# Altium schematic sheet Power_and_ST-link_zone.SchDoc
size A4; SheetNumber: 1; SheetTotal: 5
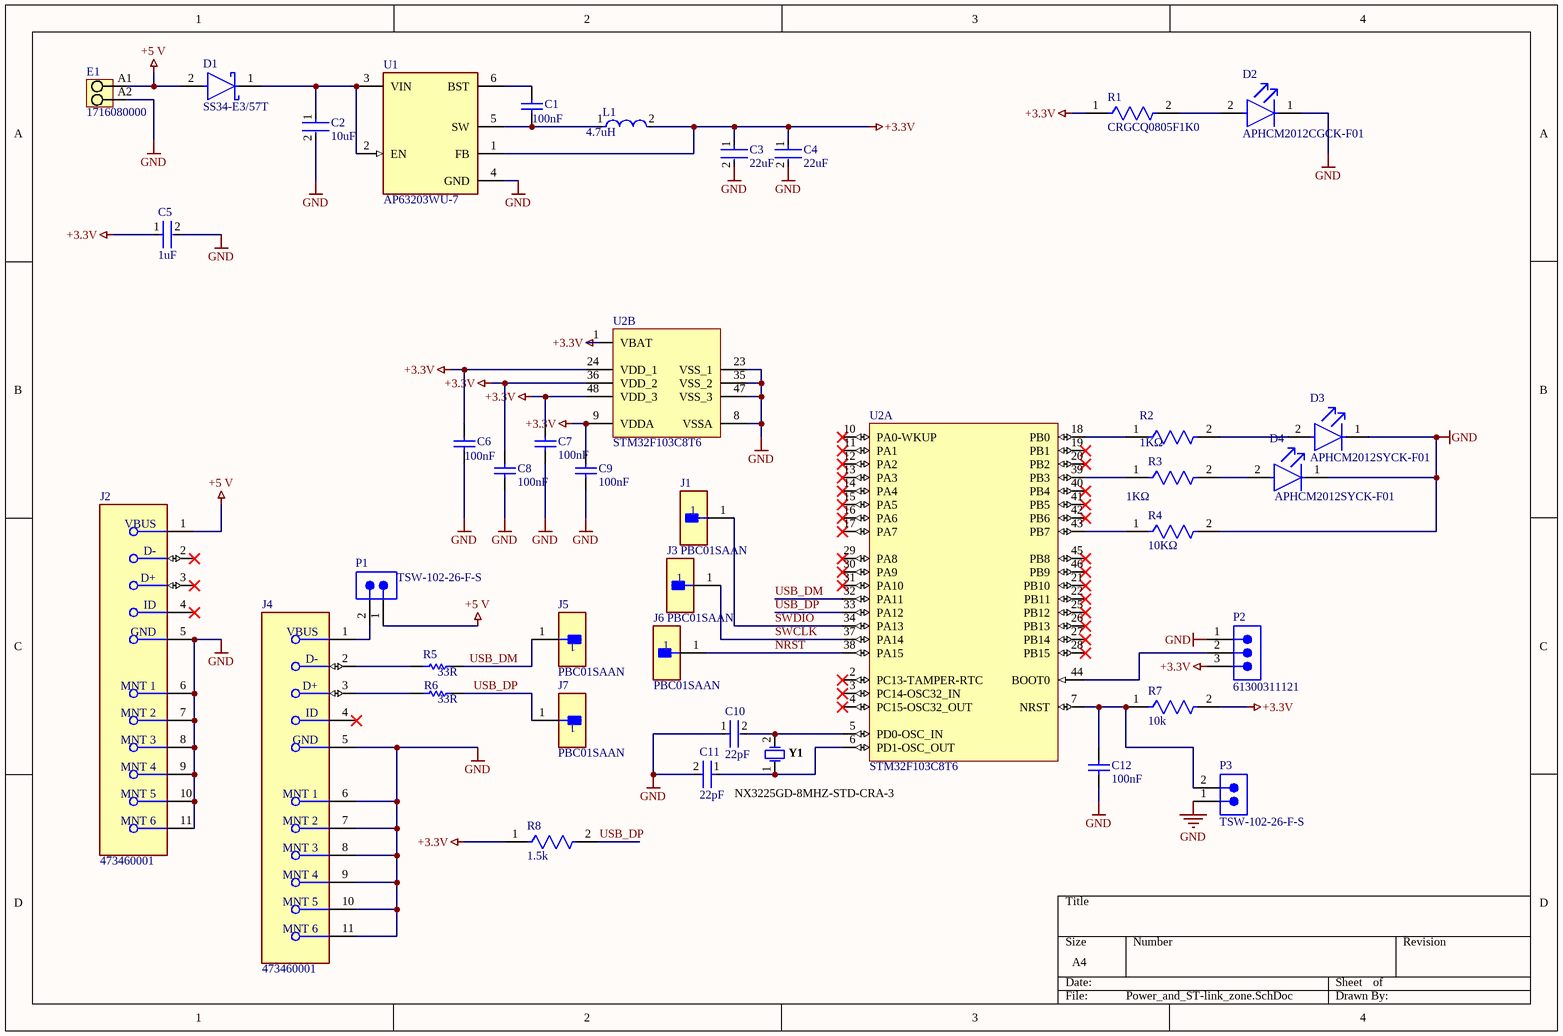
[diagram p0: Power_and_ST-link_zone.SchDoc]

## Parts
C1  100nF  [CAPC2013X145X50NL20T25]
C2  10uF  [FP-C1206C-EH-MFG]
C3  22uF  [FP-GRM21B-0_2-e0_2_0_7-MFG]
C4  22uF  [FP-GRM21B-0_2-e0_2_0_7-MFG]
C5  1uF  [FP-CC0805-0_85-MFG]
C6  100nF  [CAPC2013X145X50NL20T25]
C7  100nF  [CAPC2013X145X50NL20T25]
C8  100nF  [CAPC2013X145X50NL20T25]
C9  100nF  [CAPC2013X145X50NL20T25]
C10  22pF  [FP-C0805C-DN-MFG]
C11  22pF  [FP-C0805C-DN-MFG]
C12  100nF  [CAPC2013X145X50NL20T25]
D1  SS34-E3/57T  [FP-95402-MFG]
D2  APHCM2012CGCK-F01  [FP-APHCM2012CGCK-F01-MFG]
D3  APHCM2012SYCK-F01  [FP-APHCM2012SYCK-F01-MFG]
D4  APHCM2012SYCK-F01  [FP-APHCM2012SYCK-F01-MFG]
E1  1716080000  [LM_5_08_90_02]
J1  PBC01SAAN  [FP-PBC01SAAN-MFG]
J2  473460001  [FP-473460001-MFG]
J3  PBC01SAAN  [FP-PBC01SAAN-MFG]
J4  473460001  [FP-473460001-MFG]
J5  PBC01SAAN  [FP-PBC01SAAN-MFG]
J6  PBC01SAAN  [FP-PBC01SAAN-MFG]
J7  PBC01SAAN  [FP-PBC01SAAN-MFG]
L1  4.7uH  [FP-DEM3518C-MFG]
P1  TSW-102-26-F-S  [SMTC-TSW-102-26-XX-S]
P2  61300311121  [61300311121]
P3  TSW-102-26-F-S  [SMTC-TSW-102-26-XX-S]
R1  CRGCQ0805F1K0  [FP-CRGCQ0805-IPC_C]
R2  1KΩ  [FP-CRGCQ0805-IPC_C]
R3  1KΩ  [FP-CRGCQ0805-IPC_C]
R4  10KΩ  [FP-CRGP0805-IPC_C]
R5  33R  [RESC2013X50X30ML20T20]
R6  33R  [RESC2013X50X30ML20T20]
R7  10k  [FP-CRGP0805-IPC_C]
R8  1.5k  [FP-CRGCQ0805-IPC_C]
U1  AP63203WU-7  [FP-TSOT26-MFG]
U2  STM32F103C8T6  [STM-LQFP48_L]  (parts A,B of 2)
Y1  NX3225GD-8MHZ-STD-CRA-3  [NDK-NX3225GD-8MHZ-STD-CRA-3_V]

## Nets
+3.3V: C3.1 C4.1 C5.1 C6.2 C7.2 C8.2 C9.2 L1.2 P2.3 R1.1 R7.2 R8.1 U1.1(FB) U2.1(VBAT) U2.9(VDDA) U2.24(VDD_1) U2.36(VDD_2) U2.48(VDD_3)
+5 V: D1.2(A) E1.A1 J2.1(VBUS) P1.1
GND: C2.2 C3.2 C4.2 C5.2 C6.1 C7.1 C8.1 C9.1 C10.1 C11.2 C12.1 D2.1(C) D3.1(C) D4.1(C) E1.A2 J2.5(GND) J2.6(MNT_1) J2.7(MNT_2) J2.8(MNT_3) J2.9(MNT_4) J2.10(MNT_5) J2.11(MNT_6) J4.5(GND) J4.6(MNT_1) J4.7(MNT_2) J4.8(MNT_3) J4.9(MNT_4) J4.10(MNT_5) J4.11(MNT_6) P2.1 P3.1 R4.2 U1.4(GND) U2.8(VSSA) U2.23(VSS_1) U2.35(VSS_2) U2.47(VSS_3)
NRST: J6.1 U2.38(PA15)
SWCLK: J3.1 U2.37(PA14)
SWDIO: J1.1 U2.34(PA13)
USB_DM: J5.1 R5.2 U2.32(PA11)
USB_DP: J7.1 R6.2 R8.2 U2.33(PA12)
NetC1_1: C1.1 L1.1 U1.5(SW)
NetC1_2: C1.2 U1.6(BST)
NetC2_1: C2.1 D1.1(C) U1.2(EN) U1.3(VIN)
NetC10_2: C10.2 U2.5(PD0-OSC_IN) Y1.2
NetC11_1: C11.1 U2.6(PD1-OSC_OUT) Y1.1
NetC12_2: C12.2 P3.2 R7.1 U2.7(NRST)
NetD2_2: D2.2(A) R1.2
NetD3_2: D3.2(A) R2.2
NetD4_2: D4.2(A) R3.2
NetJ4_1: J4.1(VBUS) P1.2
NetJ4_2: J4.2(D-) R5.1
NetJ4_3: J4.3(D+) R6.1
NetP2_2: P2.2 U2.44(BOOT0)
NetR2_1: R2.1 U2.18(PB0)
NetR3_1: R3.1 U2.39(PB3)
NetR4_1: R4.1 U2.43(PB7)

Not connected (* = marked no-connect by the designer): J2 2(D-)* 3(D+)* 4(ID)*; J4 4(ID)*; U2 2(PC13-TAMPER-RTC)* 3(PC14-OSC32_IN)* 4(PC15-OSC32_OUT)* 10(PA0-WKUP)* 11(PA1)* 12(PA2)* 13(PA3)* 14(PA4)* 15(PA5)* 16(PA6)* 17(PA7)* 19(PB1)* 20(PB2)* 21(PB10)* 22(PB11)* 25(PB12)* 26(PB13)* 27(PB14)* 28(PB15)* 29(PA8)* 30(PA9)* 31(PA10)* 40(PB4)* 41(PB5)* 42(PB6)* 45(PB8)* 46(PB9)*

## Library data of the parts
C1 C6-C9 C12 = CMP-2007-01227-1: Manufacturer: Kemet; Part Number: C0805S104K5RACTU
C2 = CMP-03020-004605-1: CAP CER 10UF 25V X7R 1206; Manufacturer Part Number: C1206C106K3RACAUTO; Manufacturer: KEMET; Material: Ceramic; Automotive Grade: Grade 1; Temperature Coefficient: 15%; Tolerance: 10%; Digikey Description: CAP CER 10UF 25V X7R 1206; Lead Free: Yes; Temperature Characteristic: X7R; Temperature: -55°C to +125°C; Temperature Range Low: -55°C; Octopart: https://octopart.com/c1206c106k3racauto-kemet-65707106; Temperature Range High: +125°C; RoHS: TRUE; Package: C1206C-EH; Device Class L1: Passive Components; Device Class L3: Ceramic Capacitors; Automotive: Yes; Value: 10uF; Category: Cap; ComponentLink2Description: Datasheet; Capacitance: 10uF; Height: 1.8mm; ComponentLink2URL: https://content.kemet.com/datasheets/KEM_C1023_X7R_AUTO_SMD.pdf; Voltage Rating: 25V; Device Class L2: Capacitors; Ipc Land Pattern Name: CAPC320160X160
C3 C4 = CMP-06035-051066-1: Chip Multilayer Ceramic Capacitors for General Purpose, 0805, 22uF, X7R, 15%, 20%, 10V
C5 = CMP-03422-000058-1: CC0805 1 uF X7R 10.00% 16 V; Manufacturer: Yageo; Manufacturer Part Number: CC0805KFX7R7BB105; Material: Ceramic; Tolerance: 0.1; Voltage Rating: 16 V; ComponentLink2URL: http://www.yageo.com/documents/recent/UPY-GPHC_Y5V_6.3V-to-50V_8.pdf; Capacitance: 1 uF; Octopart: https://octopart.com/cc0805kfx7r7bb105-yageo-30261725; Footprint Url: http://www.yageo.com/exep/pages/download/literatures/UPY-C_GEN_24.pdf; ComponentLink2Description: Datasheet; Ipc Land Pattern Name: CAPC200125X85; Category: Cap; Device Class L1: Passive Components; Temperature Range High: +85°C; Mouser Description: Multilayer Ceramic Capacitors MLCC - SMD/SMT 1.0uF 16V X7R 10%; Height: 0.95mm; Automotive: No; Device Class L3: Ceramic Capacitors; Temperature: -30°C to +85°C; Temperature Range Low: -30°C; Temperature Characteristic: X7R; Device Class L2: Capacitors; Lead Free: Yes; Value: 1 uF; RoHS: TRUE; Package: CC0805-0.85
C10 C11 = CMP-03020-031064-1: C0805 22 pF C0G 30ppm/°C 10.00% 50 V; Manufacturer Part Number: C0805C220K5GACAUTO; Manufacturer: KEMET; Tolerance: 0.1; Voltage Rating: 50 V; Material: Ceramic; Temperature Range High: +125°C; Package: C0805C-DN; Device Class L1: Passive Components; ComponentLink2URL: https://content.kemet.com/datasheets/KEM_C1003_C0G_SMD.pdf; Lead Free: Yes; Value: 22 pF; Height: 0.88mm; Temperature: -55°C to +125°C; RoHS: TRUE; Device Class L2: Capacitors; Category: Cap; ComponentLink2Description: Datasheet; Device Class L3: Ceramic Capacitors; Automotive: No; Capacitance: 22 pF; Octopart: https://octopart.com/c0805c220k5gacauto-kemet-56246248; Temperature Coefficient: 30ppm/°C; Ipc Land Pattern Name: CAPC200125X78; Temperature Characteristic: C0G; Temperature Range Low: -55°C
D1 = CMP-02539-000012-1: DIODE SCHOTTKY 40V 3A DO214AB; Manufacturer: Vishay; Max Junction Temp: +150°C; Peak Reverse Current: 0.5mA; Max Surge Forward Current: 100A; Standoff Height: 0mm; ComponentLink2Description: Datasheet; Device Class L3: Schottky Diodes; Height: 2.62mm; Max Repetitive Reverse Voltage: 40V; Lead Free: Yes; Package: 95402; Temperature Range High: +150°C; ComponentLink2URL: http://www.vishay.com/docs/88751/ss32.pdf; Temperature: -55°C to +150°C; Footprint Url: http://www.vishay.com/docs/95402/smc.pdf; Automotive: No; Forward Current: 3A; Category: Diode; Manufacturer Part Number: SS34-E3/57T; RoHS: TRUE; Device Class L2: Diodes; Mouser Description: Schottky Diodes & Rectifiers 3.0 Amp 40 Volt; Octopart: https://octopart.com/ss34-e3%2F57t-vishay-39552907; Temperature Range Low: -55°C; Device Class L1: Discrete Semiconductors; Digikey Description: DIODE SCHOTTKY 40V 3A DO214AB
D2 = CMP-44529-000062-1: LED GREEN CLEAR CHIP SMD; Dominant Wavelength: 570nm; Forward Current: 20mA; Number of LEDs: 1; Luminous Intensity: 40mcd; Forward Voltage: 2.1V; Viewing Angle: 110°; Illumination Color: Green; Lens Style: Clear; Mount: Surface Mount; Length: 2mm; Max Operating Temperature: 85°C; Series: APHCM; Width: 1.25mm; Lead Free: Lead Free; Wavelength: 570nm; Package Quantity: 1; Number of Pins: 2; Case Code (Metric): 2012; RoHS Compliant: Yes; Packaging: Tape and Reel; Lens Color: Clear; Case/Package: 0805; Case Code (Imperial): 0805; Test Current: 20mA; Color: Green; Min Operating Temperature: -40°C; Height: 0.4mm
D3 D4 = CMP-44529-000064-1: LED YELLOW CLEAR CHIP SMD; Number of LEDs: 1; Luminous Intensity: 150mcd; Dominant Wavelength: 590nm; Test Current: 20mA; Illumination Color: Green; Forward Voltage: 2V; Viewing Angle: 110°; Number of Pins: 2; Packaging: Tape and Reel; Width: 1.25mm; Height: 0.4mm; Lens Color: Clear; RoHS Compliant: Yes; Lead Free: Lead Free; Min Operating Temperature: -40°C; Case Code (Imperial): 0805; Case/Package: 0805; Series: APHCM; Wavelength: 590nm; Max Operating Temperature: 85°C; Length: 2mm; Color: Yellow; Package Quantity: 2000; Mount: Surface Mount; Lens Style: Clear; Forward Current: 20mA; Case Code (Metric): 2012
E1 = CMP-1559-01766-1: OMNIMATE Signal - series LM; Manufacturer: Weidmueller; Solder_pin_length_mm: 3,5 mm; Solid_max_H05_07_V_U: 2,5 mm²; Contact_material: Cu-Leg; No_of_poles: 2; Mounting_onto_the_PCB: Solder connection; Contact_surface: tinned; Wire_cross_section_AWG_max_UL_1059: AWG 14; Rated_voltage_for_surge_voltage_class_pollution_degree_II_2: 630 V; Side_termination_characteristic: closed side; UL_94_flammability_rating: V-0; Wire_cross_section_AWG_min_UL_1059: AWG 24; Pitch_mm: 5,08 mm; Pitch_inch: 0,2 inch; Rated_voltage_use_group_B_UL_1059: 300 V; Solid_min_H05_07_V_U: 0,2 mm²; Short_text_for_material: LM 5.08/02/90 3.5SN OR BX; Insulating_material: Wemid (PA); Rated_current_use_group_B_UL_1059: 15 A; PartNumber: 1716080000; Colour: Orange; ComponentLink1URL: http://www.weidmueller.com/; ComponentLink1Description: Manufacturer URL; Revision: V1; Qty: 500 PCS; ComponentLink2Description: URL Link1; ComponentLink2URL: http://catalog.weidmueller.com/catalog/Start.do?localeId=en&ObjectID=1716080000; Packaging: Box; PackageReference: LM_5_08_90_02
J1 J3 J5-J7 = CMP-25680-000032-1: CONN HEADER VERT 1POS; Number of Positions: 1; Connector Type: Male Pin; Gender: Male; Pitch: 2.54mm; Contact Material: Bronze; Mount: Through Hole; Length: 2.54mm; Height: 2.54mm; Lead Free: Lead Free; Number of Rows: 1; Contact Plating: Gold; Number of Contacts: 1; Housing Material: Plastic; Termination: Solder; Package Quantity: 1; Packaging: Bulk; Color: Black; Contact Mating Length: 0.23inch; Housing Color: Black; Width: 2.54mm
J2 J4 = CMP-2000-05246-2: CONN RCPT USB2.0 MICRO B SMD R/A; Manufacturer: Molex; Conn Orientation: Right Angle; Is Female: yes; Shielding: true; Pitch: 0.65mm; Number Of Contacts: 5; Voltage Rating: 30V; Current Rating: 1.8A; Device Class L2: USB Connectors; Digikey Description: CONN RCPT USB2.0 MICRO B SMD R/A; Height: 2.945mm; RoHS: TRUE; ComponentLink2Description: Datasheet; Octopart: https://octopart.com/47346-0001-molex-7164928; Automotive: No; Package: 0; Category: Conn; Device Class L1: Connectors; Usb Standard: USB 2.0; Temperature: -30°C to +85°C; Temperature Range Low: -30°C; Footprint Url: https://www.molex.com/pdm_docs/sd/473460001_sd.pdf; ComponentLink2URL: https://www.molex.com/webdocs/datasheets/pdf/en-us/0473460001_IO_CONNECTORS.pdf; Lead Free: Yes; Manufacturer Part Number: 473460001; Contact Material: Gold,Nickel; Temperature Range High: +85°C; Device Class L3: unset
L1 = CMP-06042-016301-1: FIXED IND; Shielding: Shielded; Saturation Current: 1.35A; Test Frequency: 100kHz; DC Resistance (DCR): 72mR; Core Material: Ferrite; Current Rating: 2A; Tolerance: 20%; Height - Seated (Max): 0.071inch; RoHS Compliant: Yes; Length: 0.146inch; Min Operating Temperature: -40°C; Max Operating Temperature: 85°C; Mount: Surface Mount; Case/Package: Nonstandard; Width: 0.154inch; Packaging: Tape and Reel; Resistor Type: Wirewound; Inductance: 4.7uH
P1 P3 = CMP-1024-00329-1: 0.025" SQ Post Header, Through-hole, Vertical, -55 to 125 degC, 2.54 mm Pitch, 2-Pin, Male, RoHS; Manufacturer: Samtec; Pitch: 2.54 mm; PackageVersion: DM, 8/1988; ComponentLink2Description: Datasheet; PackageReference: TSW-102-26-XX-S; ComponentLink3URL: http://www.samtec.com/documents/webfiles/cpdf/TSW-XXX-XX-XXX-X-XX-XXX-MKT.pdf; ComponentLink2URL: http://www.samtec.com/documents/webfiles/pdf/TSW_TH.PDF; ComponentLink1Description: Manufacturer URL; DatasheetVersion: F-214; RoHS: True; ComponentLink3Description: Package Specification; PartNumber: TSW-102-26-F-S; Temperature Range: -55 to 125 degC; Orientation: Vertical; ComponentLink1URL: http://www.samtec.com; PackageDescription: .025[0.64] SQ. Post Terminal Strip Assembly; Mounting Technology: Through-hole
P2 = CMP-1502-01062-3: NexarPartId: 32855521; Current Rating: 3A; Voltage Rating: 250V; Number of Positions: 3; Pitch: 2.54mm; Contact Resistance: 20mΩ; Connector Type: Male Pin; Gender: Male; REACH SVHC: Unknown; Packaging: Bulk; Contact Material: Copper; Min Operating Temperature: -40°C; Number of Rows: 1; Orientation: Vertical; RoHS: Compliant; Contact Plating: Gold; Max Operating Temperature: 105°C; Mount: Through Hole; Height: 8.94mm; Operating Supply Voltage: 250V; Number of Pins: 3; Contact Mating Length: 5.9944mm; Number of Contacts: 3; Color: Black; Lead Free: Lead Free; Lead Pitch: 2.54mm; Termination: Solder
R1 = CMP-03211-004613-1: CRGCQ 0805 1K0 1%; Manufacturer: TE Connectivity; Value: 1KΩ; Power Rating: 0.125W; Temperature Coefficient: ±100ppm/°C; Tolerance: 0.01; Automotive Grade: Grade 685; Voltage Rating: 150V; Digikey Description: CRGCQ 0805 1K0 1%; Octopart: https://octopart.com/crgcq0805f1k0-te+connectivity-91018154; ComponentLink2Description: Datasheet; Ipc Land Pattern Name: RESC200125X55; Device Class L2: Resistors; Device Class L1: Passive Components; Category: Res; Device Class L3: Chip SMD Resistors; Temperature Range Low: -55°C; Temperature Range High: +155°C; Automotive: Yes; Height: 0.65mm; Resistance: 1KΩ; ComponentLink2URL: https://www.te.com/commerce/DocumentDelivery/DDEController?Action=showdoc&DocId=Data+Sheet%7F1773204-3%7F1%7Fpdf%7FEnglish%7FENG_DS_1773204-3_1.pdf%7F4-2176341-694; Manufacturer Part Number: CRGCQ0805F1K0; Series: CRGCQ; Temperature: -55°C to +155°C; Composition: Thick Film; Lead Free: Yes; RoHS: TRUE; Ambient Temperature Range High: +70°C; Package: CRGCQ0805
R2 R3 = CMP-03211-004613-1: CRGCQ 0805 1K0 1%; Manufacturer: TE Connectivity; Manufacturer Part Number: CRGCQ0805F1K0; Power Rating: 0.125W; Temperature Coefficient: ±100ppm/°C; Tolerance: 0.01; Automotive Grade: Grade 685; Voltage Rating: 150V; Digikey Description: CRGCQ 0805 1K0 1%; Octopart: https://octopart.com/crgcq0805f1k0-te+connectivity-91018154; ComponentLink2Description: Datasheet; Ipc Land Pattern Name: RESC200125X55; Device Class L2: Resistors; Value: 1KΩ; Device Class L1: Passive Components; Category: Res; Device Class L3: Chip SMD Resistors; Temperature Range Low: -55°C; Temperature Range High: +155°C; Automotive: Yes; Height: 0.65mm; Resistance: 1KΩ; ComponentLink2URL: https://www.te.com/commerce/DocumentDelivery/DDEController?Action=showdoc&DocId=Data+Sheet%7F1773204-3%7F1%7Fpdf%7FEnglish%7FENG_DS_1773204-3_1.pdf%7F4-2176341-694; Series: CRGCQ; Temperature: -55°C to +155°C; Composition: Thick Film; Lead Free: Yes; RoHS: TRUE; Ambient Temperature Range High: +70°C; Package: CRGCQ0805
R4 = CMP-03211-006861-1: CRGP 0805 10K 1%; Manufacturer Part Number: CRGP0805F10K; Manufacturer: TE; Power Rating: 0.33W; Voltage Rating: 150V; Tolerance: 0.01; Temperature Coefficient: ±100ppm/°C; ComponentLink2URL: https://www.mouser.com/datasheet/2/418/NG_DS_9-1773463-9_A-1358566.pdf; Temperature Range Low: -55°C; Ipc Land Pattern Name: RESC200125X55; Device Class L2: Resistors; Automotive: No; Device Class L3: Chip SMD Resistors; Composition: Thick Film; Temperature Range High: +155°C; Temperature: -55°C to +155°C; Height: 0.65mm; Series: CRGP; RoHS: TRUE; Device Class L1: Passive Components; Value: 10KΩ; Octopart: https://octopart.com/crgp0805f10k-te+connectivity-91018782; Package: CRGP0805; Digikey Description: CRGP 0805 10K 1%; Ambient Temperature Range High: +70°C; Lead Free: Yes; ComponentLink2Description: Datasheet; Category: Res; Resistance: 10KΩ
R5 R6 = CMP-1013-00038-2: Manufacturer: Vishay Dale; Part Number: CRCW080533R0JNEA
R7 = CMP-03211-006861-1: CRGP 0805 10K 1%; Manufacturer Part Number: CRGP0805F10K; Manufacturer: TE; Power Rating: 0.33W; Voltage Rating: 150V; Value: 10KΩ; Tolerance: 0.01; Temperature Coefficient: ±100ppm/°C; ComponentLink2URL: https://www.mouser.com/datasheet/2/418/NG_DS_9-1773463-9_A-1358566.pdf; Temperature Range Low: -55°C; Ipc Land Pattern Name: RESC200125X55; Device Class L2: Resistors; Automotive: No; Device Class L3: Chip SMD Resistors; Composition: Thick Film; Temperature Range High: +155°C; Temperature: -55°C to +155°C; Height: 0.65mm; Series: CRGP; RoHS: TRUE; Device Class L1: Passive Components; Octopart: https://octopart.com/crgp0805f10k-te+connectivity-91018782; Package: CRGP0805; Digikey Description: CRGP 0805 10K 1%; Ambient Temperature Range High: +70°C; Lead Free: Yes; ComponentLink2Description: Datasheet; Category: Res; Resistance: 10KΩ
R8 = CMP-03211-002424-1: CRGCQ0805 1.5KΩ 0.125W ±100ppm/°C 1% 150V; Manufacturer: TE Connectivity; Manufacturer Part Number: CRGCQ0805F1K5; Tolerance: 0.01; Automotive Grade: Grade 721; Power Rating: 0.125W; Resistance: 1.5KΩ; Temperature Range High: +155°C; Automotive: Yes; Series: CRGCQ; Octopart: https://octopart.com/crgcq0805f1k5-te+connectivity-91018156; Temperature: -55°C to +155°C; Device Class L2: Resistors; Height: 0.65mm; Composition: Thick Film; Ipc Land Pattern Name: RESC200125X55; Voltage Rating: 150V; Ambient Temperature Range High: +70°C; Temperature Range Low: -55°C; RoHS: TRUE; Lead Free: Yes; Value: 1.5KΩ; Device Class L3: Chip SMD Resistors; Temperature Coefficient: ±100ppm/°C; ComponentLink2Description: Datasheet; Category: Res; Device Class L1: Passive Components; ComponentLink2URL: https://www.te.com/commerce/DocumentDelivery/DDEController?Action=showdoc&DocId=Data+Sheet%7F1773204-3%7F1%7Fpdf%7FEnglish%7FENG_DS_1773204-3_1.pdf%7F4-2176341-730; Package: CRGCQ0805
U1 = CMP-12757-000006-1: IC REG BUCK 3.3V 2A TSOT26; Manufacturer: Diodes Inc.; Output Type: Fixed; Min Supply Voltage: 3.8V; Number Of Outputs: 1; Max Junction Temp: +160°C; Nominal Supply Current: 22uA; Standoff Height: 0.01mm; Switching Frequency: 1.1MHz; Max Supply Voltage: 32V; ComponentLink2Description: Datasheet; Device Class L1: Integrated Circuits (ICs); Temperature: to +160°C; Device Class L3: Voltage Regulators - Switching; RoHS: TRUE; Octopart: https://octopart.com/ap63203wu-7-diodes+inc.-98099550; Output Voltage: 3.3V; Lead Free: Yes; ComponentLink2URL: https://www.diodes.com/assets/Datasheets/AP63200-AP63201-AP63203-AP63205.pdf; Digikey Description: IC REG BUCK 3.3V 2A TSOT26; Footprint Url: https://www.diodes.com/assets/Package-Files/TSOT26.pdf; Ambient Temperature Range High: +85°C; Height: 1mm; Automotive: No; Temperature Range High: +160°C; Switching Topology: Buck; Output Current: 2A; Package: TSOT26; Category: IC; Mouser Description: AP63203 Series 3.3 V 2 A SMT Fixed Low IQ Synchronous Buck - TSOT-26; Device Class L2: Power Management ICs; Ambient Temperature Range Low: -40°C; Manufacturer Part Number: AP63203WU-7
U2 = CMP-0237-00215-3: ARM Cortex-M3 32-bit MCU, 64 KB Flash, 20 KB Internal RAM, 37 I/Os, 48-pin LQFP, -40 to 85 degC, Tray; Supply Voltage(Vcc) min (V): 2; Internal RAM Size (kB): 20; FLASH Size (Prog) (kB): 64; A/D Converter: 2x12-bit (10 Channel); I/Os (High Current): 37; Operating Frequency(F) (Processor speed) (MHz): 72; Core: ARM Cortex-M3; ComponentLink3Description: Package Specification; Mounting Technology: Surface Mount; PartNumber: STM32F103C8T6; PackageReference: LQFP48; Packing: Tray; ComponentLink3URL: http://www.st.com/st-web-ui/static/active/en/resource/technical/document/datasheet/DM00058181.pdf; DatasheetVersion: Rev. 16; ComponentLink1URL: http://www.st.com/web/en/home.html; PackageVersion: Rev. 6, 06/2013; ComponentLink2URL: http://www.st.com/st-web-ui/static/active/en/resource/technical/document/datasheet/CD00161566.pdf; ComponentLink1Description: Manufacturer URL; ComponentLink2Description: Datasheet; PackageDescription: 48-Pin Low Profile Quad Flat Package, 7 x 7 mm Body, 0.5 mm Pitch
Y1 = CMP-2000-07595-1: Crystal Unit, 8 MHz, 8 pF, -40 to 150 degC, 2-Pin SMD, RoHS, Tape and Reel; Manufacturer: NDK; Load Capacitance: 8pF; ESR (Equivalent Series Resistance): 500Ohm; Frequency Tolerance: 50ppm; Frequency Stability: 150ppm; Frequency: 8MHz; Case/Package: SMD/SMT; Datasheet Version: 11/2016; Min Operating Temperature: -40degC; Packaging: TapeandReel; Width: 0.098inch; Package Quantity: 3000; Number of Pins: 2; Package Description: 2-Pin Surface Mount Device, Body 3.2 x 2.5 mm; RoHSCompliant: True; Package Reference: NX3225GD-8MHZ-STD-CRA-3; Datasheet URL: http://www.ndk.com/images/products/catalog/c_NX3225GD-STD-CRA-3_e.pdf; Mounting Technology: SurfaceMount; Length: 0.126inch; Mount: SurfaceMount; Manufacturer URL: http://www.ndk.com/en/; Max Operating Temperature: 150degC; Height: 0.039inch